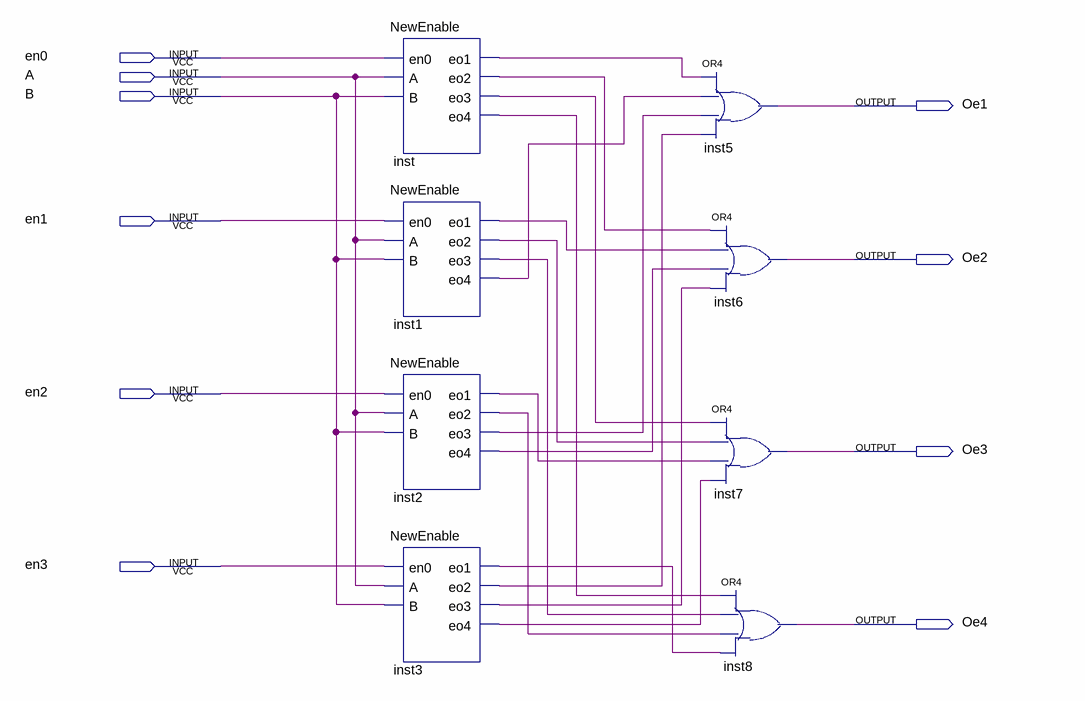
[diagram p0: schematic sheet]
// Quartus schematic MuxEnable.bdf as structural Verilog: 8 symbols, 10 pins
module MuxEnable (
  input  en0,
  input  A,
  input  B,
  input  en1,
  input  en2,
  input  en3,
  output Oe1,
  output Oe2,
  output Oe3,
  output Oe4
);

  wire inst1_eo1, inst1_eo2, inst1_eo3, inst1_eo4, inst2_eo1, inst2_eo2, inst2_eo3, inst2_eo4, inst3_eo1,
       inst3_eo2, inst3_eo3, inst3_eo4, inst_eo1, inst_eo2, inst_eo3, inst_eo4;

  NewEnable inst (.en0(en0), .A(A), .B(B), .eo1(inst_eo1), .eo2(inst_eo2), .eo3(inst_eo3), .eo4(inst_eo4));
  NewEnable inst1 (.en0(en1), .A(A), .B(B), .eo1(inst1_eo1), .eo2(inst1_eo2), .eo3(inst1_eo3), .eo4(inst1_eo4));
  NewEnable inst2 (.en0(en2), .A(A), .B(B), .eo1(inst2_eo1), .eo2(inst2_eo2), .eo3(inst2_eo3), .eo4(inst2_eo4));
  NewEnable inst3 (.en0(en3), .A(A), .B(B), .eo1(inst3_eo1), .eo2(inst3_eo2), .eo3(inst3_eo3), .eo4(inst3_eo4));
  or inst5 (Oe1, inst_eo1, inst1_eo4, inst2_eo3, inst3_eo2);
  or inst6 (Oe2, inst_eo2, inst1_eo1, inst2_eo4, inst3_eo3);
  or inst7 (Oe3, inst_eo3, inst1_eo2, inst2_eo1, inst3_eo4);
  or inst8 (Oe4, inst_eo4, inst1_eo3, inst2_eo2, inst3_eo1);
endmodule
